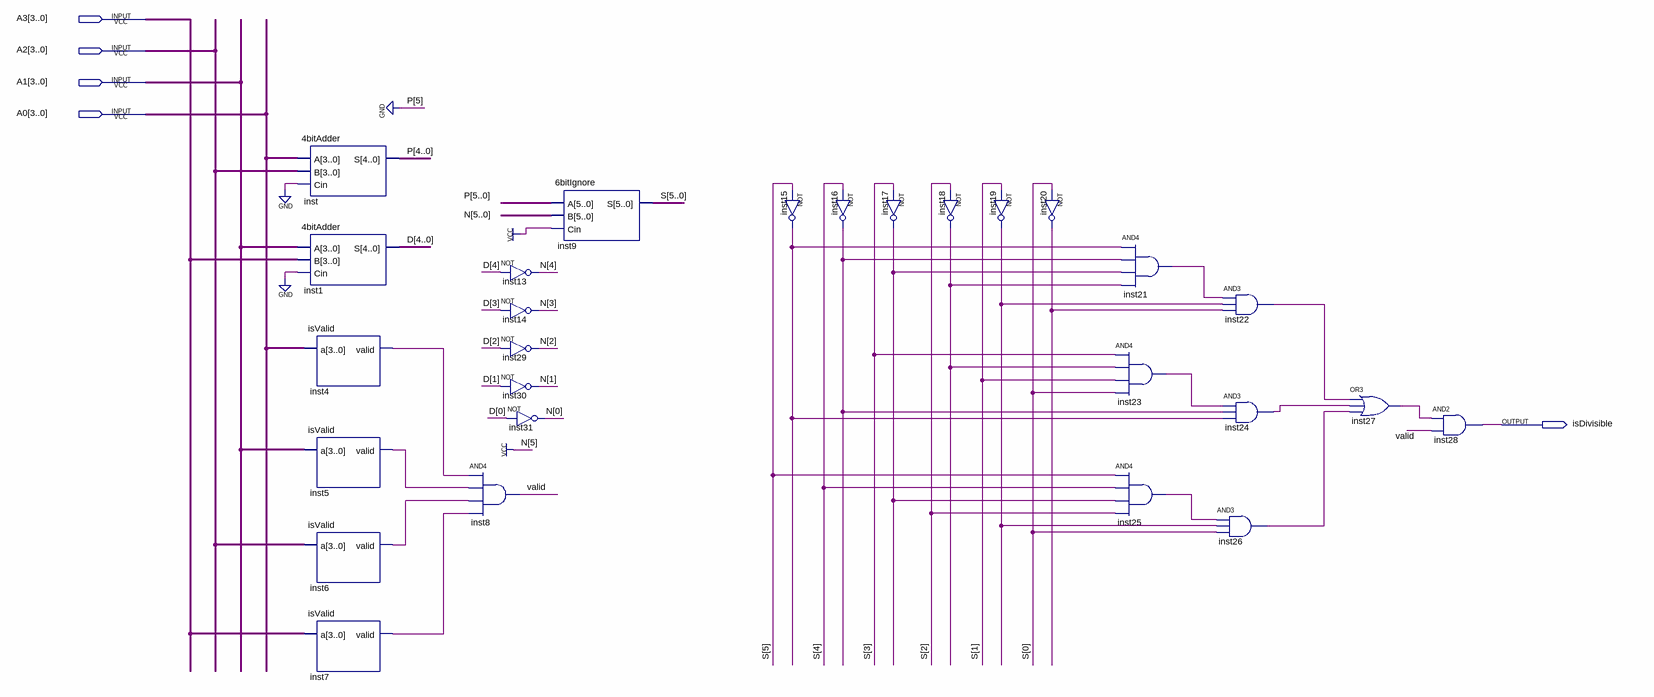
[diagram p0: schematic sheet]
// Quartus schematic div11.bdf as structural Verilog: 27 symbols, 5 pins
module div11 (
  input  [3:0] A3,
  input  [3:0] A2,
  input  [3:0] A1,
  input  [3:0] A0,
  output isDivisible
);

  wire inst4_valid, inst5_valid, inst6_valid, inst7_valid, inst15_out, inst16_out, inst17_out, inst18_out,
       inst19_out, inst20_out, inst21_out, inst22_out, inst23_out, inst24_out, inst25_out, inst26_out,
       inst27_out, valid;
  wire [4:0] D, N, P;
  wire [5:0] S;

  \4bitAdder  inst (.A(A0), .B(A2), .Cin(1'b0), .S(P));
  \4bitAdder  inst1 (.A(A1), .B(A3), .Cin(1'b0), .S(D));
  isValid inst4 (.a(A0), .valid(inst4_valid));
  isValid inst5 (.a(A1), .valid(inst5_valid));
  isValid inst6 (.a(A2), .valid(inst6_valid));
  isValid inst7 (.a(A3), .valid(inst7_valid));
  and inst8 (valid, inst4_valid, inst5_valid, inst6_valid, inst7_valid);
  not inst13 (N[4], D[4]);
  not inst14 (N[3], D[3]);
  not inst29 (N[2], D[2]);
  not inst30 (N[1], D[1]);
  not inst31 (N[0], D[0]);
  \6bitIgnore  inst9 (.A({1'b0, P}), .B({1'b1, N}), .Cin(1'b1), .S(S));
  not inst15 (inst15_out, S[5]);
  not inst16 (inst16_out, S[4]);
  not inst17 (inst17_out, S[3]);
  not inst18 (inst18_out, S[2]);
  not inst19 (inst19_out, S[1]);
  not inst20 (inst20_out, S[0]);
  and inst21 (inst21_out, inst15_out, inst16_out, inst17_out, inst18_out);
  and inst23 (inst23_out, S[3], inst18_out, S[1], S[0]);
  and inst25 (inst25_out, S[5], S[4], inst17_out, S[2]);
  and inst22 (inst22_out, inst21_out, inst19_out, inst20_out);
  and inst24 (inst24_out, inst23_out, inst16_out, inst15_out);
  and inst26 (inst26_out, inst25_out, inst19_out, S[0]);
  or inst27 (inst27_out, inst22_out, inst24_out, inst26_out);
  and inst28 (isDivisible, inst27_out, valid);
endmodule
